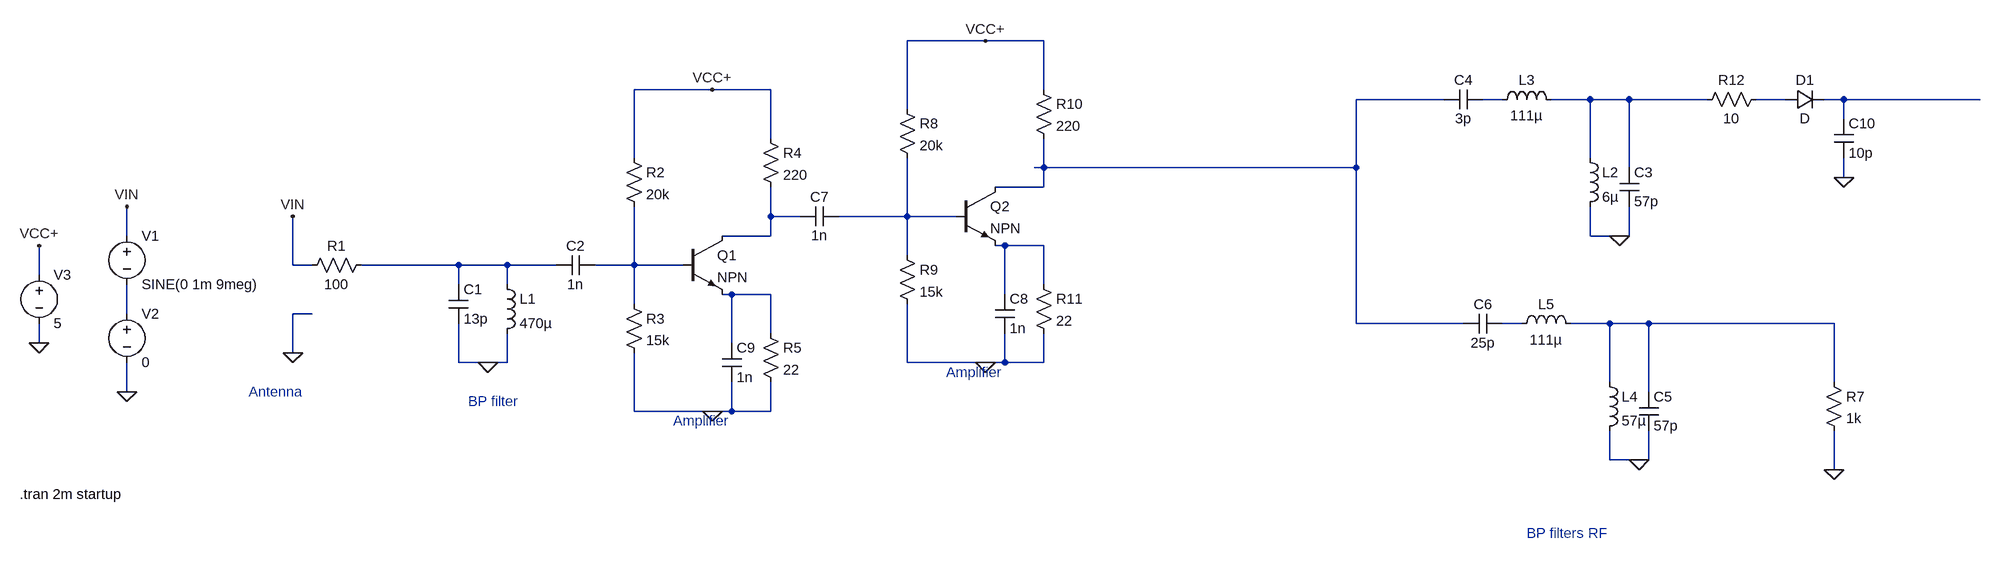
[diagram p0: schematic general.asc]
general.asc, the LTspice schematic file:
Version 4
SHEET 1 2680 680
WIRE 992 -320 864 -320
WIRE 1088 -320 992 -320
WIRE 544 -240 416 -240
WIRE 640 -240 544 -240
WIRE 1088 -240 1088 -320
WIRE 1744 -224 1600 -224
WIRE 1840 -224 1808 -224
WIRE 1984 -224 1920 -224
WIRE 2048 -224 1984 -224
WIRE 2176 -224 2048 -224
WIRE 2304 -224 2256 -224
WIRE 2400 -224 2368 -224
WIRE 2624 -224 2400 -224
WIRE 864 -208 864 -320
WIRE 2400 -192 2400 -224
WIRE 640 -160 640 -240
WIRE 416 -128 416 -240
WIRE 1984 -128 1984 -224
WIRE 1088 -112 1088 -160
WIRE 1088 -112 1072 -112
WIRE 1600 -112 1600 -224
WIRE 1600 -112 1088 -112
WIRE 2048 -112 2048 -224
WIRE 2400 -96 2400 -128
WIRE 1088 -80 1088 -112
WIRE 1088 -80 1008 -80
WIRE 640 -32 640 -80
WIRE 688 -32 640 -32
WIRE 864 -32 864 -128
WIRE 864 -32 752 -32
WIRE 944 -32 864 -32
WIRE -416 0 -416 -48
WIRE 640 0 640 -32
WIRE 640 0 560 0
WIRE 1984 0 1984 -48
WIRE 2032 0 1984 0
WIRE 2048 0 2048 -48
WIRE 2048 0 2032 0
WIRE 1024 16 1008 16
WIRE 1088 16 1024 16
WIRE 864 32 864 -32
WIRE -144 48 -144 -32
WIRE -112 48 -144 48
WIRE 128 48 -32 48
WIRE 208 48 128 48
WIRE 288 48 208 48
WIRE 416 48 416 -48
WIRE 416 48 352 48
WIRE 496 48 416 48
WIRE -560 64 -560 16
WIRE 128 80 128 48
WIRE 208 80 208 48
WIRE 1088 80 1088 16
WIRE 576 96 560 96
WIRE 640 96 576 96
WIRE 1024 96 1024 16
WIRE 416 112 416 48
WIRE -416 128 -416 80
WIRE -112 128 -144 128
WIRE 1600 144 1600 -112
WIRE 1776 144 1600 144
WIRE 1872 144 1840 144
WIRE 2016 144 1952 144
WIRE 2080 144 2016 144
WIRE 2384 144 2080 144
WIRE 640 160 640 96
WIRE -560 176 -560 144
WIRE 576 176 576 96
WIRE -144 192 -144 128
WIRE 128 208 128 144
WIRE 176 208 128 208
WIRE 208 208 208 160
WIRE 208 208 176 208
WIRE 864 208 864 112
WIRE 992 208 864 208
WIRE 1024 208 1024 160
WIRE 1024 208 992 208
WIRE 1088 208 1088 160
WIRE 1088 208 1024 208
WIRE 2016 240 2016 144
WIRE 2384 240 2384 144
WIRE -416 256 -416 208
WIRE 2080 256 2080 144
WIRE 416 288 416 192
WIRE 544 288 416 288
WIRE 576 288 576 240
WIRE 576 288 544 288
WIRE 640 288 640 240
WIRE 640 288 576 288
WIRE 2016 368 2016 320
WIRE 2064 368 2016 368
WIRE 2080 368 2080 320
WIRE 2080 368 2064 368
WIRE 2384 384 2384 320
FLAG -144 192 0
FLAG 176 208 0
FLAG -560 176 0
FLAG -416 256 0
FLAG 544 288 0
FLAG -560 16 VCC+
FLAG 544 -240 VCC+
FLAG -416 -48 VIN
FLAG -144 -32 VIN
FLAG 2384 384 0
FLAG 2032 0 0
FLAG 2064 368 0
FLAG 992 208 0
FLAG 992 -320 VCC+
FLAG 2400 -96 0
SYMBOL cap 112 80 R0
SYMATTR InstName C1
SYMATTR Value 13p
SYMBOL ind 192 64 R0
SYMATTR InstName L1
SYMATTR Value 470µ
SYMBOL res -16 32 R90
WINDOW 0 0 56 VBottom 2
WINDOW 3 32 56 VTop 2
SYMATTR InstName R1
SYMATTR Value 100
SYMBOL voltage -416 -16 R0
WINDOW 123 0 0 Left 0
WINDOW 39 0 0 Left 0
SYMATTR InstName V1
SYMATTR Value SINE(0 1m 9meg)
SYMBOL voltage -416 112 R0
WINDOW 123 0 0 Left 0
WINDOW 39 0 0 Left 0
SYMATTR InstName V2
SYMATTR Value 0
SYMBOL res 400 -144 R0
SYMATTR InstName R2
SYMATTR Value 20k
SYMBOL res 400 96 R0
SYMATTR InstName R3
SYMATTR Value 15k
SYMBOL cap 352 32 R90
WINDOW 0 0 32 VBottom 2
WINDOW 3 32 32 VTop 2
SYMATTR InstName C2
SYMATTR Value 1n
SYMBOL res 624 -176 R0
SYMATTR InstName R4
SYMATTR Value 220
SYMBOL res 624 144 R0
SYMATTR InstName R5
SYMATTR Value 22
SYMBOL npn 496 0 R0
SYMATTR InstName Q1
SYMBOL voltage -560 48 R0
WINDOW 123 0 0 Left 0
WINDOW 39 0 0 Left 0
SYMATTR InstName V3
SYMATTR Value 5
SYMBOL cap 560 176 R0
SYMATTR InstName C9
SYMATTR Value 1n
SYMBOL res 2368 224 R0
SYMATTR InstName R7
SYMATTR Value 1k
SYMBOL ind 1968 -144 R0
SYMATTR InstName L2
SYMATTR Value 6µ
SYMBOL ind 1824 -208 R270
WINDOW 0 32 56 VTop 2
WINDOW 3 5 56 VBottom 2
SYMATTR InstName L3
SYMATTR Value 111µ
SYMBOL cap 2032 -112 R0
SYMATTR InstName C3
SYMATTR Value 57p
SYMBOL cap 1808 -240 R90
WINDOW 0 0 32 VBottom 2
WINDOW 3 32 32 VTop 2
SYMATTR InstName C4
SYMATTR Value 3p
SYMBOL ind 2000 224 R0
SYMATTR InstName L4
SYMATTR Value 57µ
SYMBOL ind 1856 160 R270
WINDOW 0 32 56 VTop 2
WINDOW 3 5 56 VBottom 2
SYMATTR InstName L5
SYMATTR Value 111µ
SYMBOL cap 2064 256 R0
SYMATTR InstName C5
SYMATTR Value 57p
SYMBOL cap 1840 128 R90
WINDOW 0 0 32 VBottom 2
WINDOW 3 32 32 VTop 2
SYMATTR InstName C6
SYMATTR Value 25p
SYMBOL cap 752 -48 R90
WINDOW 0 0 32 VBottom 2
WINDOW 3 32 32 VTop 2
SYMATTR InstName C7
SYMATTR Value 1n
SYMBOL res 848 -224 R0
SYMATTR InstName R8
SYMATTR Value 20k
SYMBOL res 848 16 R0
SYMATTR InstName R9
SYMATTR Value 15k
SYMBOL res 1072 -256 R0
SYMATTR InstName R10
SYMATTR Value 220
SYMBOL res 1072 64 R0
SYMATTR InstName R11
SYMATTR Value 22
SYMBOL npn 944 -80 R0
SYMATTR InstName Q2
SYMBOL cap 1008 96 R0
SYMATTR InstName C8
SYMATTR Value 1n
SYMBOL res 2272 -240 R90
WINDOW 0 0 56 VBottom 2
WINDOW 3 32 56 VTop 2
SYMATTR InstName R12
SYMATTR Value 10
SYMBOL diode 2304 -208 R270
WINDOW 0 32 32 VTop 2
WINDOW 3 0 32 VBottom 2
SYMATTR InstName D1
SYMBOL cap 2384 -192 R0
SYMATTR InstName C10
SYMATTR Value 10p
TEXT -216 256 Left 2 ;Antenna
TEXT 144 272 Left 2 ;BP filter
TEXT 480 304 Left 2 ;Amplifier
TEXT -592 424 Left 2 !.tran 2m startup
TEXT 1880 488 Left 2 ;BP filters RF
TEXT 928 224 Left 2 ;Amplifier

The netlist it stands for:
* general.asc
C1 N009 0 13p
L1 N009 0 470µ
R1 N009 VIN 100
V1 VIN N012 SINE(0 1m 9meg)
V2 N012 0 0
R2 VCC+ N010 20k
R3 N010 0 15k
C2 N010 N009 1n
R4 VCC+ N006 220
R5 N011 0 22
Q1 N006 N010 N011 0 NPN
V3 VCC+ 0 5
C9 N011 0 1n
R7 N014 0 1k
L2 N003 0 6µ
L3 N002 N003 111µ
C3 N003 0 57p
C4 N002 N001 3p
L4 N014 0 57µ
L5 N013 N014 111µ
C5 N014 0 57p
C6 N013 N001 25p
C7 N007 N006 1n
R8 VCC+ N007 20k
R9 N007 0 15k
R10 VCC+ N001 220
R11 N008 0 22
Q2 N001 N007 N008 0 NPN
C8 N008 0 1n
R12 N004 N003 10
D1 N004 N005 D
C10 N005 0 10p
.model D D
.lib standard.dio
.model NPN NPN
.model PNP PNP
.lib standard.bjt
* Antenna
* BP filter
* Amplifier
.tran 2m startup
* BP filters RF
* Amplifier
.backanno
.end